# Altium schematic sheet Muxes_and_ADC.SchDoc
size 431 x 279 mm; Organization: ORGANIZATION; Address1: ADDRESS 1; Address2: ADDRESS 2; Address3: ADDRESS 3; Address4: ADDRESS 4; Revision: -; SheetNumber: 4; SheetTotal: 4; ENG_APP_DATE: --/--/--; DSN_APP_DATE: --/--/--; CHK_APP_DATE: --/--/--
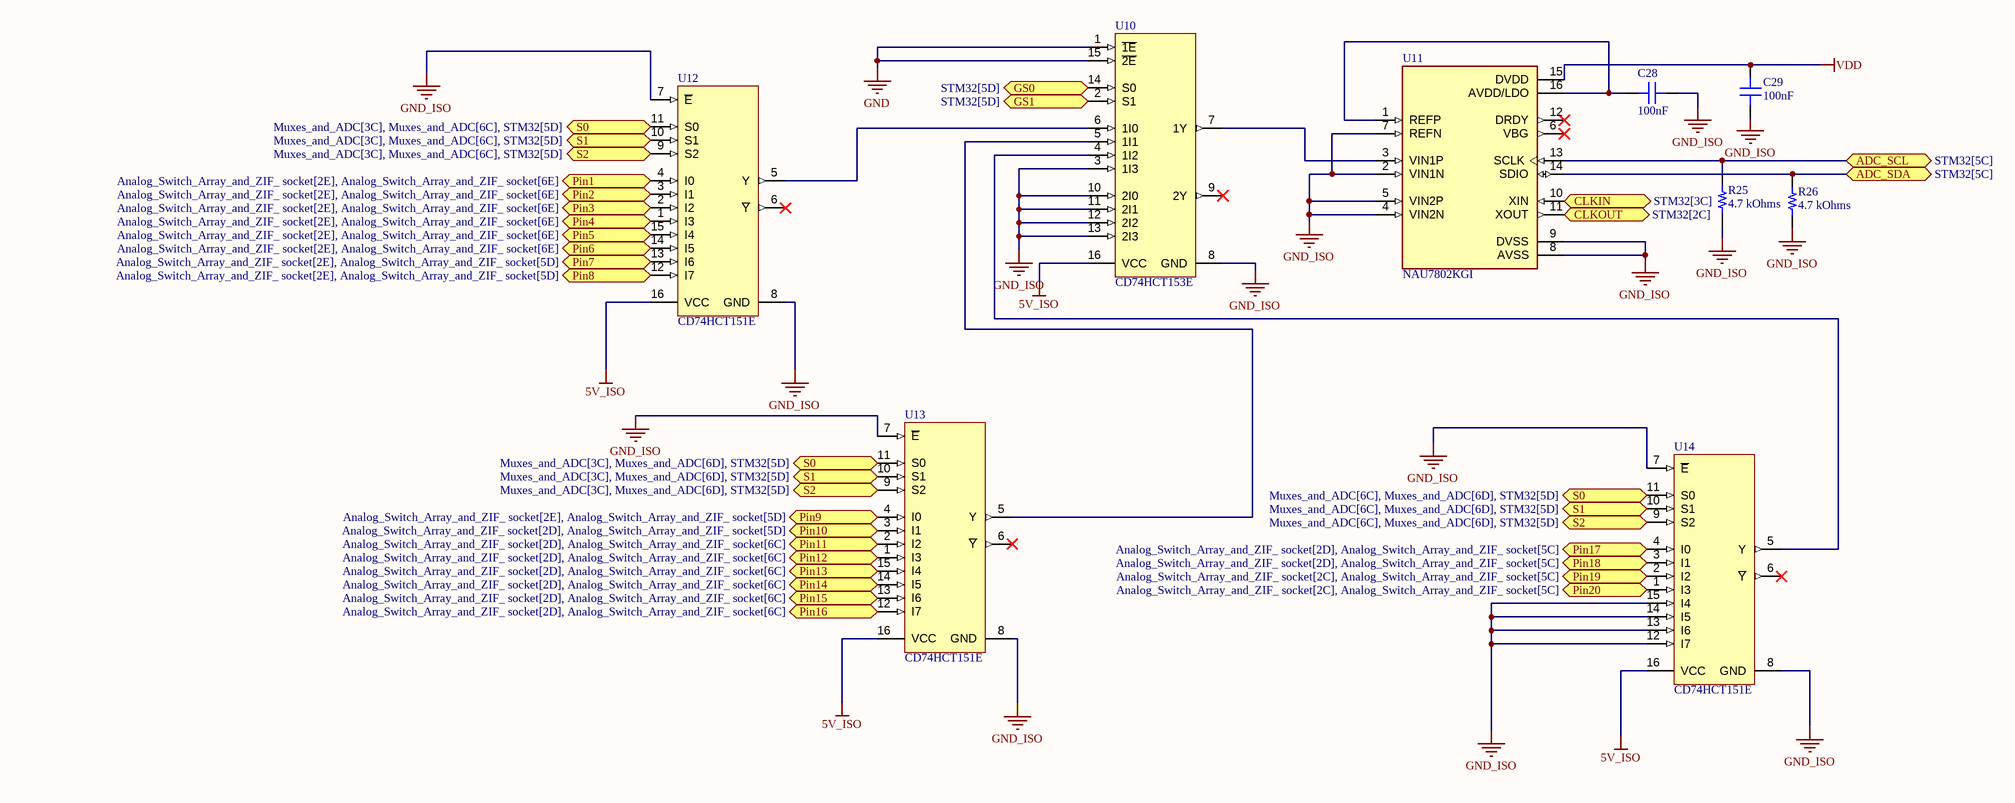
[diagram p0: Muxes_and_ADC.SchDoc]

## Parts
C28  value 100nF  [CAP 1206_3216 - 0.8MM]  (hidden comment: C1206X104G4HAC7800)
C29  value 100nF  [CAP 1206_3216 - 0.8MM]  (hidden comment: C1206X104G4HAC7800)
R25  value 4.7 kOhms  [RES 0603_1608]  (hidden comment: KTR03EZPF4701)
R26  value 4.7 kOhms  [RES 0603_1608]  (hidden comment: KTR03EZPF4701)
U10  CD74HCT153E  [N0016A]
U11  NAU7802KGI  [DIP792W45P254L1904H533Q16]
U12  CD74HCT151E  [N0016A]
U13  CD74HCT151E  [N0016A]
U14  CD74HCT151E  [N0016A]

## Ports
ADC_SCL (bidir, see STM32[5C]), ADC_SDA (bidir, see STM32[5C]), CLKIN (bidir, see STM32[3C]), CLKOUT (bidir, see STM32[2C]), GS0 (bidir, see STM32[5D]), GS1 (bidir, see STM32[5D]), Pin1 (bidir, see Analog_Switch_Array_and_ZIF_ socket[2E], Analog_Switch_Array_and_ZIF_ socket[6E]), Pin2 (bidir, see Analog_Switch_Array_and_ZIF_ socket[2E], Analog_Switch_Array_and_ZIF_ socket[6E]), Pin3 (bidir, see Analog_Switch_Array_and_ZIF_ socket[2E], Analog_Switch_Array_and_ZIF_ socket[6E]), Pin4 (bidir, see Analog_Switch_Array_and_ZIF_ socket[2E], Analog_Switch_Array_and_ZIF_ socket[6E]), Pin5 (bidir, see Analog_Switch_Array_and_ZIF_ socket[2E], Analog_Switch_Array_and_ZIF_ socket[6E]), Pin6 (bidir, see Analog_Switch_Array_and_ZIF_ socket[2E], Analog_Switch_Array_and_ZIF_ socket[6E]), Pin7 (bidir, see Analog_Switch_Array_and_ZIF_ socket[2E], Analog_Switch_Array_and_ZIF_ socket[5D]), Pin8 (bidir, see Analog_Switch_Array_and_ZIF_ socket[2E], Analog_Switch_Array_and_ZIF_ socket[5D]), Pin9 (bidir, see Analog_Switch_Array_and_ZIF_ socket[2E], Analog_Switch_Array_and_ZIF_ socket[5D]), Pin10 (bidir, see Analog_Switch_Array_and_ZIF_ socket[2D], Analog_Switch_Array_and_ZIF_ socket[5D]), Pin11 (bidir, see Analog_Switch_Array_and_ZIF_ socket[2D], Analog_Switch_Array_and_ZIF_ socket[6C]), Pin12 (bidir, see Analog_Switch_Array_and_ZIF_ socket[2D], Analog_Switch_Array_and_ZIF_ socket[6C]), Pin13 (bidir, see Analog_Switch_Array_and_ZIF_ socket[2D], Analog_Switch_Array_and_ZIF_ socket[6C]), Pin14 (bidir, see Analog_Switch_Array_and_ZIF_ socket[2D], Analog_Switch_Array_and_ZIF_ socket[6C]), Pin15 (bidir, see Analog_Switch_Array_and_ZIF_ socket[2D], Analog_Switch_Array_and_ZIF_ socket[6C]), Pin16 (bidir, see Analog_Switch_Array_and_ZIF_ socket[2D], Analog_Switch_Array_and_ZIF_ socket[6C]), Pin17 (bidir, see Analog_Switch_Array_and_ZIF_ socket[2D], Analog_Switch_Array_and_ZIF_ socket[5C]), Pin18 (bidir, see Analog_Switch_Array_and_ZIF_ socket[2D], Analog_Switch_Array_and_ZIF_ socket[5C]), Pin19 (bidir, see Analog_Switch_Array_and_ZIF_ socket[2C], Analog_Switch_Array_and_ZIF_ socket[5C]), Pin20 (bidir, see Analog_Switch_Array_and_ZIF_ socket[2C], Analog_Switch_Array_and_ZIF_ socket[5C]), S0 (bidir, see Muxes_and_ADC[3C], Muxes_and_ADC[6C], STM32[5D]), S0 (bidir, see Muxes_and_ADC[3C], Muxes_and_ADC[6D], STM32[5D]), S0 (bidir, see Muxes_and_ADC[6C], Muxes_and_ADC[6D], STM32[5D]), S1 (bidir, see Muxes_and_ADC[3C], Muxes_and_ADC[6C], STM32[5D]), S1 (bidir, see Muxes_and_ADC[3C], Muxes_and_ADC[6D], STM32[5D]), S1 (bidir, see Muxes_and_ADC[6C], Muxes_and_ADC[6D], STM32[5D]), S2 (bidir, see Muxes_and_ADC[3C], Muxes_and_ADC[6C], STM32[5D]), S2 (bidir, see Muxes_and_ADC[3C], Muxes_and_ADC[6D], STM32[5D]), S2 (bidir, see Muxes_and_ADC[6C], Muxes_and_ADC[6D], STM32[5D])

## Nets
5V_ISO: U10.16(VCC) U12.16(VCC) U13.16(VCC) U14.16(VCC)
GND: U10.1(~{1E}) U10.15(~{2E})
GND_ISO: C28.1 C29.2 R25.1 R26.1 U10.3(1I3) U10.8(GND) U10.10(2I0) U10.11(2I1) U10.12(2I2) U10.13(2I3) U11.2(VIN1N) U11.4(VIN2N) U11.5(VIN2P) U11.7(REFN) U11.8(AVSS) U11.9(DVSS) U12.7(~{E}) U12.8(GND) U13.7(~{E}) U13.8(GND) U14.7(~{E}) U14.8(GND) U14.12(I7) U14.13(I6) U14.14(I5) U14.15(I4)
VDD: C29.1 U11.15(DVDD)
ADC_SCL: R25.2 U11.13(SCLK) ; port ADC_SCL
ADC_SDA: R26.2 U11.14(SDIO) ; port ADC_SDA
CLKIN: U11.10(XIN) ; port CLKIN
CLKOUT: U11.11(XOUT) ; port CLKOUT
GS0: U10.14(S0) ; port GS0
GS1: U10.2(S1) ; port GS1
Pin1: U12.4(I0) ; port Pin1
Pin2: U12.3(I1) ; port Pin2
Pin3: U12.2(I2) ; port Pin3
Pin4: U12.1(I3) ; port Pin4
Pin5: U12.15(I4) ; port Pin5
Pin6: U12.14(I5) ; port Pin6
Pin7: U12.13(I6) ; port Pin7
Pin8: U12.12(I7) ; port Pin8
Pin9: U13.4(I0) ; port Pin9
Pin10: U13.3(I1) ; port Pin10
Pin11: U13.2(I2) ; port Pin11
Pin12: U13.1(I3) ; port Pin12
Pin13: U13.15(I4) ; port Pin13
Pin14: U13.14(I5) ; port Pin14
Pin15: U13.13(I6) ; port Pin15
Pin16: U13.12(I7) ; port Pin16
Pin17: U14.4(I0) ; port Pin17
Pin18: U14.3(I1) ; port Pin18
Pin19: U14.2(I2) ; port Pin19
Pin20: U14.1(I3) ; port Pin20
S0: U12.11(S0) U13.11(S0) U14.11(S0) ; port S0
S1: U12.10(S1) U13.10(S1) U14.10(S1) ; port S1
S2: U12.9(S2) U13.9(S2) U14.9(S2) ; port S2
NetC28_2: C28.2 U11.1(REFP) U11.16(AVDD/LDO)
NetU10_4: U10.4(1I2) U14.5(Y)
NetU10_5: U10.5(1I1) U13.5(Y)
NetU10_6: U10.6(1I0) U12.5(Y)
NetU10_7: U10.7(1Y) U11.3(VIN1P)

Not connected (* = marked no-connect by the designer): U10 9(2Y)*; U11 6(VBG)* 12(DRDY)*; U12 6(~{Y})*; U13 6(~{Y})*; U14 6(~{Y})*

## Notes on the sheet
- DWG. NO.
- REV.
- SHT.
- THIS DOCUMENT AND THE DATA DISCLOSED HEREIN OR HEREWITH IS THE PROPERTY OF ALTIUM LIMITED AND MAY BE FREELY DISTRIBUTED IN WHOLE. NO RIGHTS ARE RESERVED OR EXPRESS OR IMPLIED WARANTEE GIVEN.
- REVISION
- DESCRIPTION
- DATE
- APPROVED
- ENG:
- APPROVALS
- PROJECT
- DSN:
- CHK:
- REFERENCE DOCUMENTS
- PROJECT REVISION:
- TITLE
- DOCUMENT REVISION:
- DESIGN ITEM:
- BOM:
- FAB DWG:
- PCB DWG:
- ASSY DWG:
- SCALE:
- SIZE
- B
- CAGE CODE
- FILE NAME
- DWG NO.
- SHEET
- OF
- REV

## Library data of the parts
C28 C29 = CMP-001-063573-1: CAP CER 1206 0.1F 16V ULTRA STAB; Part Number: C1206X104G4HAC7800
R25 R26 = CMP-009-042855-1: RES SMD 4.7K OHM 1% 1/10W 0603; Part Number: KTR03EZPF4701
U10 = CMP-1633-00665-2: High Speed CMOS Logic Dual 4-Input Multiplexers, N0016A, TUBE; Manufacturer: Texas Instruments; VCC(Max)(V): 5.5; Voltage(Nom)(V): 5; ICC @ Nom Voltage(Max)(mA): 0.08; Configuration: 4：1; Rating: Catalog; tpd @ Nom Voltage(Max)(ns): 43; F @ Nom Voltage(Max)(Mhz): 25; VCC(Min)(V): 4.5; Function: Encoder/Multiplexer; Technology Family: HCT; Schmitt Trigger: No; Bits(#): 4; Input Type: TTL; Channels(#): 2; Output Drive (IOL/IOH)(Max)(mA): 4/-4; Output Type: CMOS; Operating Temperature Range(C): -55 to 125; Type: Standard; Code_JEDEC: MS-001; Generic Part Number: CD74HCT153; PackageReference: N0016A; DatasheetVersion: SCHS151C
U11 = CMP-00254-1: 24 Bit Analog to Digital Converter 2 Input 1 Sigma-Delta 16-PDIP; MF: Nuvoton Technology Corporation of America; Source: NAU7802KGI.SchLib; SnapEDA_Link: https://www.snapeda.com/parts/NAU7802KGI/Nuvoton/view-part/?ref=snap; Check_prices: https://www.snapeda.com/parts/NAU7802KGI/Nuvoton/view-part/?ref=eda; Pin Count: 16; Package: Package; Component Type: Standard; Value: *; Design Item ID: NAU7802KGI; MP: NAU7802KGI
U12-U14 = CMP-1633-00678-2: High Speed CMOS Logic 8-Input Multiplexer, N0016A, TUBE; Manufacturer: Texas Instruments; Output Drive (IOL/IOH)(Max)(mA): 4/-4; Technology Family: HCT; Input Type: TTL; F @ Nom Voltage(Max)(Mhz): 25; Rating: Catalog; Bits(#): 8; VCC(Min)(V): 4.5; VCC(Max)(V): 5.5; Schmitt Trigger: No; tpd @ Nom Voltage(Max)(ns): 48; ICC @ Nom Voltage(Max)(mA): 0.08; Channels(#): 1; Function: Encoder/Multiplexer; Configuration: 8：1; Voltage(Nom)(V): 5; Generic Part Number: CD74HCT151; PackageReference: N0016A; Output Type: CMOS; Code_JEDEC: MS-001; DatasheetVersion: SCHS150C; Type: Standard; Operating Temperature Range(C): -55 to 125